# Altium schematic sheet DownLoad.SchDoc
size A4
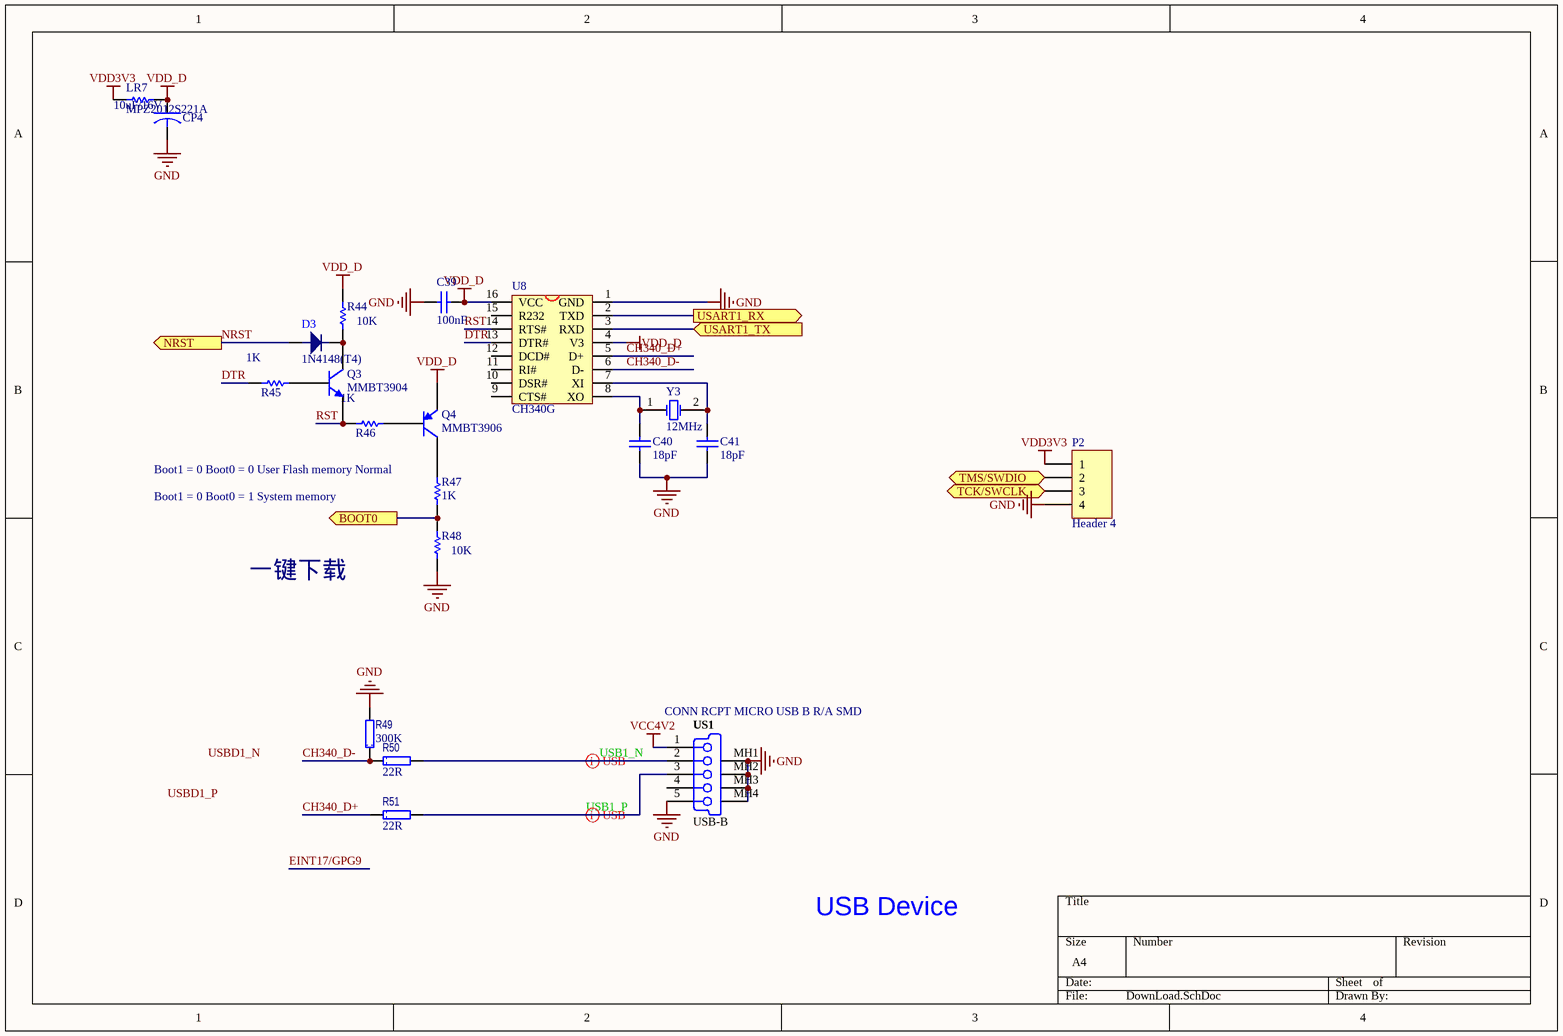
[diagram p0: DownLoad.SchDoc]

## Parts
C39  value 100nF  [2012[0805]06CD]  (hidden comment: CAP 100nF 50V 0805(2012))
C40  value 18pF  [2012[0805]100_L]  (hidden comment: CAP 18pF 50V 0805(2012))
C41  value 18pF  [2012[0805]100_L]  (hidden comment: CAP 18pF 50V 0805(2012))
CP4  value 10uF/16V  [3216[1206]CB]  (hidden comment: TAJA106K016RNJ)
D3  1N4148(T4)  [SOD123]
LR7  MPZ2012S221A  [2012[0805]RL]
P2  Header 4  [HDR1X4]
Q3  MMBT3904  [SOT23_N]
Q4  MMBT3906  [SOT23B_N]
R44  value 10K  [2012[0805]R]  (hidden comment: 10K 1% 0805(2012))
R45  value 1K  [2012[0805]R]  (hidden comment: 1K 1% 0805(2012))
R46  value 1K  [2012[0805]R]  (hidden comment: 1K 1% 0805(2012))
R47  value 1K  [2012[0805]R]  (hidden comment: 1K 1% 0805(2012))
R48  value 10K  [2012[0805]R]  (hidden comment: 10K 1% 0805(2012))
R49  value 300K  [2012[0805]R]  (hidden comment: CRCW0603300KFKEA)
R50  value 22R  [2012[0805]R]  (hidden comment: CRCW060322R0FKEA)
R51  value 22R  [2012[0805]R]  (hidden comment: CRCW060322R0FKEA)
U8  CH340G  [SOIC16_N]
US1  USB-B  Description 1: CONN RCPT MICRO USB B R/A SMD  [USB_micro_AB]
Y3  12MHz  [XTAL_HC-49]

## Ports
BOOT0 (out), NRST (out), TCK/SWCLK (in), TMS/SWDIO (bidir), USART1_RX (out), USART1_TX (in)

## Nets
GND: C39.2 C40.2 C41.2 CP4.2 P2.4 R48.1 R49.2 U8.1(GND) US1.5 US1.MH1 US1.MH2 US1.MH3 US1.MH4
VCC4V2: US1.1
VDD3V3: LR7.1 P2.1
VDD_D: C39.1 CP4.1 LR7.2 Q4.2(E) R44.2 U8.4(V3) U8.16(VCC)
BOOT0: R47.1 R48.2 ; port BOOT0
CH340_D+: R51.1 U8.5(D+)
CH340_D-: R49.1 R50.1 U8.6(D-)
DTR: R45.1 U8.13(DTR#)
NRST: D3.1 ; port NRST
RST: Q3.2(E) R46.1 U8.14(RTS#)
TCK/SWCLK: P2.3 ; port TCK/SWCLK
TMS/SWDIO: P2.2 ; port TMS/SWDIO
USART1_RX: U8.2(TXD) ; port USART1_RX
USART1_TX: U8.3(RXD) ; port USART1_TX
USB1_N: R50.2 US1.2
USB1_P: R51.2 US1.3
NetC40_1: C40.1 U8.8(XO) Y3.1(OSC1)
NetC41_1: C41.1 U8.7(XI) Y3.2(OSC2)
NetD3_2: D3.2 Q3.3(C) R44.1
NetQ3_1: Q3.1(B) R45.2
NetQ4_1: Q4.1(B) R46.2
NetQ4_3: Q4.3(C) R47.2

Not connected (* = marked no-connect by the designer): U8 9(CTS#) 10(DSR#) 11(RI#) 12(DCD#) 15(R232); US1 4

## Layout directives
differential pair: USB1_N, USB1_P

## Notes on the sheet
- Boot1 = 0 Boot0 = 0 User Flash memory Normal
- Boot1 = 0 Boot0 = 1 System memory
- 一键下载
- USB Device
- Labels drawn without touching a wire or pin: USBD1_N, USBD1_P

## Library data of the parts
C39 = CMP-1036-04418-1: CAP 100nF 50V ±5% 0805 (2012 Metric) Thickness 1mm SMD; Case-EIA: 0805; Case-Metric: 2012; Tolerance: ±5%; Max Thickness: 1 mm; Technology: SMT; Rated Voltage: 50 V
C40 C41 = CMP-1036-01136-1: CAP 18pF 50V ±1% 0805 (2012 Metric) Thickness 0.75mm SMD; Case-EIA: 0805; Case-Metric: 2012; Technology: SMT; Tolerance: ±1%; Max Thickness: 0.75 mm; Rated Voltage: 50 V
CP4 = CAPACITOR: 钽质电容器-固体SMD 16volts 10uF 10%; Manufacturer: AVX; ESR: 3 Ohms; 产品: Tantalum Solid Standard Grade - Other Various; 产品种类: SMD Tantalum Capacitors; 制造商库存号: A Case; 外壳代码 - in: 1206; 外壳代码 - mm: 3216; 封装 / 箱体: 1206 (3216 metric); 封装: Reel; 尺寸: 1.6 mm W x 3.2 mm L; 工作温度范围: - 55 C to + 125 C; 损耗因数 DF: 8; 标准包装数量: 2000; 漏泄电流: 1.6 uA; 电压额定值: 16 V; 端接类型: SMD/SMT; 系列: TAJ; 高度: 1.8 mm; Category: 钽质电容器-固体SMD; ComponentLink1Description: http://www.avx.com/docs/Catalogs/taj.pdf; ComponentLink1URL: http://www.avx.com/docs/Catalogs/taj.pdf; Description 1: 钽质电容器-固体SMD 16volts 10uF 10%; Manufacturer Part Number: TAJA106K016RNJ; Minimum Order Quantity: 1; Pricing 1: 1=0.600, 100=0.280, 200=0.250, 500=0.221, 1000=0.200, 2000=0.140, 5000=0.131, 10000=0.124, 25000=0.103 (USD); Reeling: True; RoHS - 贸泽: Y; RoHS: RoHS Compliant; Stock 1: 20335; Supplier 1: Mouser; Supplier Part Number 1: 581-TAJA106K016R; 制造商: AVX; 容差: 10 %; 电容: 10 uF
D3 = 1N4148: 高速开关二极管
LR7 = Res Semi: 电磁干扰滤波珠子、扼流圈和阵列 Ferrite Chip Beads; Manufacturer: TDK; 阻抗: 220 Ohms; 最大直流电流: 3 A; 最大直流电阻: 0.04 Ohms; 工作温度范围: - 55 C to + 125 C; 封装 / 箱体: 2012; 封装: Reel; 端接类型: SMD/SMT; 容差: 25 %; 产品种类: Ferrite Beads; 标准包装数量: 4000; Supplier 1: Mouser; Supplier Part Number 1: 810-MPZ2012S221A; Manufacturer Part Number: MPZ2012S221A; RoHS: RoHS Compliant; Description 1: 电磁干扰滤波珠子、扼流圈和阵列 Ferrite Chip Beads; Category: 电磁干扰滤波珠子、扼流圈和阵列; Stock 1: 26540; Pricing 1: 1=0.070, 50=0.060, 100=0.053, 500=0.040, 1000=0.035, 4000=0.031, 8000=0.029, 12000=0.025 (USD); 制造商: TDK; RoHS - 贸泽: Y; Minimum Order Quantity: 1; Reeling: True; ComponentLink1URL: http://www.mouser.com/ds/2/400/e9413_mpz-24582.pdf; ComponentLink1Description: http://www.mouser.com/ds/2/400/e9413_mpz-24582.pdf
P2 = Header 4: Header, 4-Pin; LatestRevisionDate: 17-Jul-2002; LatestRevisionNote: Re-released for DXP Platform.; Publisher: Altium Limited
Q3 = MMBT3904: NPN Switching Transistor; Published: 17-Sep-2003; LatestRevisionDate: 12-Dec-2006; LatestRevisionNote: IPC-7351 Footprint Added.; DatasheetVersion: 13-May-2002; PackageVersion: May-1999; PackageReference: SOT23; Publisher: Altium Limited; PackageDescription: 3-Pin SOT-23 Package 0.95 mm Pitch, 2.3 mm Lead Span; ComponentLink1Description: Manufacturer Link; ComponentLink1URL: http://www.semiconductors.philips.com/; ComponentLink2Description: Datasheet; ComponentLink2URL: http://www.semiconductors.philips.com/acrobat/datasheets/MMBT3904_4.pdf
Q4 = MMBT3906: PNP Switching Transistor; Published: 17-Sep-2003; LatestRevisionDate: 12-Dec-2006; LatestRevisionNote: IPC-7351 Footprint Added.; DatasheetVersion: 11-Apr-2000; PackageVersion: May-1999; PackageReference: SOT23; Publisher: Altium Limited; PackageDescription: 3-Pin SOT-23 Package 0.95 mm Pitch, 2.3 mm Lead Span; ComponentLink1Description: Manufacturer Link; ComponentLink1URL: http://www.semiconductors.philips.com/; ComponentLink2Description: Datasheet; ComponentLink2URL: http://www.semiconductors.philips.com/acrobat/datasheets/MMBT3906_2.pdf
R44 R48 = CMP-1013-00623-1: 10K 0.125W 1% 0805 (2012 Metric)  SMD; Case-Metric: 2012; Case-EIA: 0805; Tolerance: 1 %; Power: 0.125 W; Technology: SMT
R45-R47 = CMP-1013-00510-1: 1K 0.125W 1% 0805 (2012 Metric)  SMD; Case-Metric: 2012; Case-EIA: 0805; Tolerance: 1 %; Power: 0.125 W; Technology: SMT
R49 = RES: 厚膜电阻器 - SMD 1/10watt 300Kohms 1%; Manufacturer: Vishay / Dale; 尺寸: 0.85 mm W x 1.55 mm L x 0.45 mm H; 工作温度范围: - 55 C to + 155 C; 封装 / 箱体: 0603 (1608 metric); 封装: Reel; 功率额定值: 100 mW; 产品: Thick Film Resistors SMD; 系列: CRCW; 温度系数: 100 PPM / K; 端接类型: SMD/SMT; 电压额定值: 75 V; 外壳代码 - in: 0603; 外壳代码 - mm: 1608; 制造商: Vishay; 产品种类: 0603 Thick Film Chip Resistors; 标准包装数量: 5000; Supplier 1: Mouser; Supplier Part Number 1: 71-CRCW0603-300K-E3; Manufacturer Part Number: CRCW0603300KFKEA; RoHS: RoHS Compliant By Exemption; Category: 厚膜电阻器 - SMD; Stock 1: 19604; Pricing 1: 1=0.080, 10=0.013, 100=0.010, 1000=0.008, 5000=0.005, 25000=0.004, 50000=0.003 (USD); 电阻: 300 kOhms; 容差: 1 %; RoHS - 贸泽: E; Minimum Order Quantity: 1; Reeling: True; ComponentLink1URL: http://www.mouser.com/ds/2/427/dcrcwe3-109170.pdf; ComponentLink1Description: http://www.mouser.com/ds/2/427/dcrcwe3-109170.pdf; Description 1: 厚膜电阻器 - SMD 1/10watt 300Kohms 1%
R50 R51 = RES: 厚膜电阻器 - SMD 1/10watt 22ohms 1%; Manufacturer: Vishay / Dale; 尺寸: 0.85 mm W x 1.55 mm L x 0.45 mm H; 工作温度范围: - 55 C to + 155 C; 封装 / 箱体: 0603 (1608 metric); 封装: Reel; 功率额定值: 100 mW; 产品: Thick Film Resistors SMD; 系列: CRCW; 温度系数: 100 PPM / K; 端接类型: SMD/SMT; 电压额定值: 75 V; 制造商: Vishay; 标准包装数量: 5000; 外壳代码 - in: 0603; 外壳代码 - mm: 1608; 产品种类: 0603 Thick Film Chip Resistors; Supplier 1: Mouser; Supplier Part Number 1: 71-CRCW0603-22-E3; Manufacturer Part Number: CRCW060322R0FKEA; RoHS: RoHS Compliant By Exemption; Category: 厚膜电阻器 - SMD; Stock 1: 35802; 电阻: 22 Ohms; 容差: 1 %; Minimum Order Quantity: 1; Reeling: True; ComponentLink1URL: http://www.mouser.com/ds/2/427/dcrcwe3-109170.pdf; ComponentLink1Description: http://www.mouser.com/ds/2/427/dcrcwe3-109170.pdf; Description 1: 厚膜电阻器 - SMD 1/10watt 22ohms 1%; Pricing 1: 1=0.080, 10=0.013, 100=0.010, 1000=0.008, 5000=0.005, 25000=0.004, 50000=0.003 (USD); RoHS - 贸泽: E
U8 = CH340G: USB2UART
US1 = D-300-0034: USB On-The-Go (OTG) Mini-B Receptacle, Right Angle, SMT, 0.80mm (.031") Pitch, Solder Tabs with Back Cover, Recessed Type; Manufacturer: TE Connectivity; Manufacturer Part Number: 1981568-1; Max Current: mA; Number of Contacts: 5; Specifications: USB 1.0; Connector type: Right Angle; Mounting Technology: Surface Mount; Status: Unreleased; Category: Connector; Supplier 1: Digi-Key; Supplier Part Number 1: A97800TR-ND; RoHS: RoHS Compliant; Stock 1: 12000; Pricing 1: 1000=0.9108, 2000=0.88044, 3000=0.85008, 5000=0.80758, 10000=0.78936 (USD); Packaging: Tape & Reel (TR); Gender: Receptacle; Mounting Type: Surface Mount, Right Angle, Horizontal; Features: -; Ingress Protection: -; ComponentLink1URL: http://www.te.com/commerce/DocumentDelivery/DDEController?Action=srchrtrv&DocNm=1981568&DocType=Customer+Drawing&DocLang=English; ComponentLink1Description: http://www.te.com/commerce/DocumentDelivery/DDEController?Action=srchrtrv&DocNm=1981568&DocType=Customer+Drawing&DocLang=English
Y3 = XTAL: Crystal Oscillator; Published: 8-Jun-2000; LatestRevisionDate: 17-Jul-2002; LatestRevisionNote: Re-released for DXP Platform.; Publisher: Altium Limited